# EAGLE design masterBoard1 (EAGLE 7.2.0)
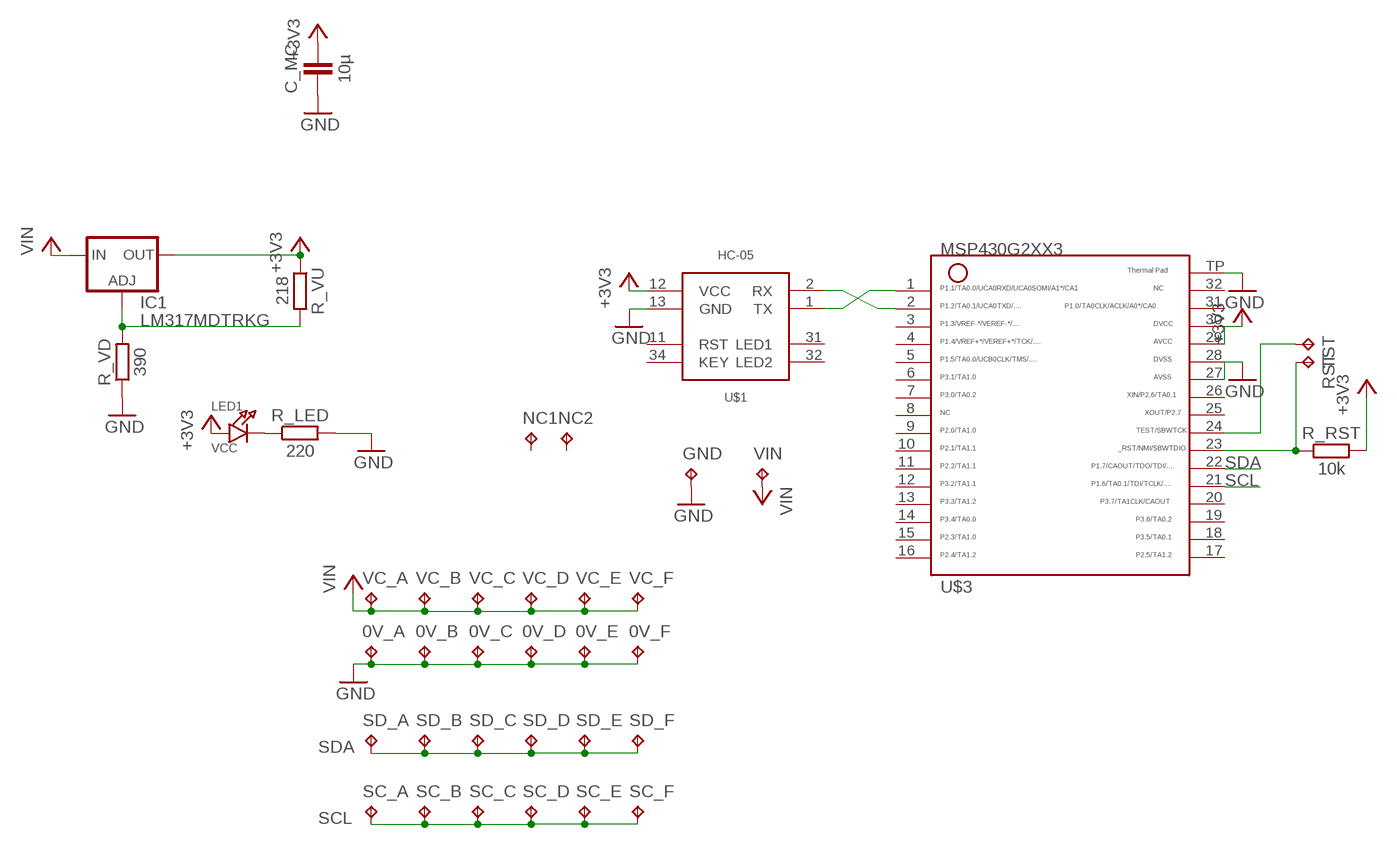
[diagram p0: schematic, sheet 1]

## Parts
0V_A  TPTP15SQ  [TP15SQ]
0V_B  TPTP15SQ  [TP15SQ]
0V_C  TPTP15SQ  [TP15SQ]
0V_D  TPTP15SQ  [TP15SQ]
0V_E  TPTP15SQ  [TP15SQ]
0V_F  TPTP15SQ  [TP15SQ]
C_MC  10µ  CAPACITOR  [603]
GND  TPTP15SQ  [TP15SQ]
IC1  LM317MDTRKG  [DPACK]
LED1  VCC  LED0805  [CHIPLED_0805]
NC1  TPTP15SQ  [TP15SQ]
NC2  TPTP15SQ  [TP15SQ]
R_LED  220  RESISTOR0603  [603]
R_RST  10k  RESISTOR0603  [603]
R_VD  390  RESISTOR0603  [603]
R_VU  218  RESISTOR0603  [603]
RST  TPTP15SQ  [TP15SQ]
SC_A  TPTP15SQ  [TP15SQ]
SC_B  TPTP15SQ  [TP15SQ]
SC_C  TPTP15SQ  [TP15SQ]
SC_D  TPTP15SQ  [TP15SQ]
SC_E  TPTP15SQ  [TP15SQ]
SC_F  TPTP15SQ  [TP15SQ]
SD_A  TPTP15SQ  [TP15SQ]
SD_B  TPTP15SQ  [TP15SQ]
SD_C  TPTP15SQ  [TP15SQ]
SD_D  TPTP15SQ  [TP15SQ]
SD_E  TPTP15SQ  [TP15SQ]
SD_F  TPTP15SQ  [TP15SQ]
TST  TPTP15SQ  [TP15SQ]
U$1  HC-05  [HC-06]
U$3  G2XX3---RHB32  [RHB32]
VC_A  TPTP15SQ  [TP15SQ]
VC_B  TPTP15SQ  [TP15SQ]
VC_C  TPTP15SQ  [TP15SQ]
VC_D  TPTP15SQ  [TP15SQ]
VC_E  TPTP15SQ  [TP15SQ]
VC_F  TPTP15SQ  [TP15SQ]
VIN  TPTP15SQ  [TP15SQ]

## Nets
+3V3: C_MC.2 IC1.4(OUT) LED1.A R_RST.2 R_VU.1 U$1.12(VCC) U$3.29 U$3.30
GND: 0V_A.TP 0V_B.TP 0V_C.TP 0V_D.TP 0V_E.TP 0V_F.TP C_MC.1 GND.TP R_LED.2 R_VD.1 U$1.13(GND) U$3.27 U$3.28 U$3.TP
N$1: LED1.C R_LED.1
N$2: R_RST.1 RST.TP U$3.23
N$3: U$1.1(TX) U$3.1
N$4: U$1.2(RX) U$3.2
N$5: TST.TP U$3.24
N$18: IC1.1(ADJ) R_VD.2 R_VU.2
SCL: SC_A.TP SC_B.TP SC_C.TP SC_D.TP SC_E.TP SC_F.TP U$3.21
SDA: SD_A.TP SD_B.TP SD_C.TP SD_D.TP SD_E.TP SD_F.TP U$3.22
VCC: IC1.3(IN) VC_A.TP VC_B.TP VC_C.TP VC_D.TP VC_E.TP VC_F.TP VIN.TP ; supply symbol labelled VIN
Unconnected: NC1.TP NC2.TP U$1.11(RST) U$1.31(LED1) U$1.32(LED2) U$1.34(KEY) U$3.3 U$3.4 U$3.5 U$3.6 U$3.7 U$3.8 U$3.9 U$3.10 U$3.11 U$3.12 U$3.13 U$3.14 U$3.15 U$3.16 U$3.17 U$3.18 U$3.19 U$3.20 U$3.25 U$3.26 U$3.31 U$3.32

## Library data of the parts
0V_A 0V_B 0V_C 0V_D 0V_E 0V_F GND NC1 NC2 RST SC_A SC_B SC_C SC_D SC_E SC_F SD_A SD_B SD_C SD_D SD_E SD_F TST VC_A VC_B VC_C VC_D VC_E VC_F VIN = testpad:TP: Test pad
C_MC = thar:CAPACITOR
IC1 = v-reg:LM317?*: 500 mA Adjustable Output Positive Voltage Regulator Source: http://www.onsemi.co.jp .. LM317M-D.PDF
LED1 = microbuilder:LED: LED 0603 - 0603 Surface Mount Package 2mA: Green LED - Low Power (3.9mcd, 2ma, 1.7Vf) - Digikey: 475-2709-2-ND Orange LED - Low Power (9.8mcd, 2ma, 1.8Vf) - Digikey: 475-1194-2-ND Red LED - Low Power (5mcd, 2ma, 1.8Vf) - Digikey: 475-1195-2-ND Yellow LED - Low Power (7mcd, 2ma, 1.8Vf) - Digikey: 475-1196-2-ND 5mA: Blue LED - Low Power (17mcd, 5ma, 2.9Vf) - Digikey: LNJ937W8CRACT-ND 0805 - 0805 Surface Mount Package 2mA: Red LED (8.8mcd, 2mA, 1.8Vf, Clear) - Low Power [Digikey: 475-2510-1-ND] Green LED (5mcd, 2mA, 1.8Vf, Clear) - Low Power [Digikey: 475-2730-1-ND] Yellow LED (11.3mcd, 2mA, 1.8Vf, Clear) - Low Power [Digikey: 475-2555-1-ND] 20mA: Red LED (104mcd, 20mA, Diffused) - LS R976 [Digikey: 475-1278-6-ND] Red LED (12mcd, 20mA, 2.0Vf, Clear) - APT2012EC [Digikey: 754-1128-1-ND] Green LED (15mcd, 20mA, 2.2Vf, Clear) - APT2012GC [Digikey: 754-1131-1-ND] Orange LED (160mcd, 20mA, 2.1Vf, Clear) - APT2012SECK [Digikey: 754-1130-1-ND] 1206 - 1206 Surface Mount Package Green LED (26mcd, 20mA, Diffused) - LG N971 [Digikey: 475-1407-6-ND] Red LED (15mcd, 20mA, Diffused) - LH N974 [Digikey: 475-1416-6-ND]
R_LED R_RST R_VD R_VU = thar:RESISTOR
U$1 = thar:HC-05: Wireless Bluetooth Transceiver Module HC-05 (Host-Slave integration) CP06001 Bezug: Ebay-Eckstein <http://stores.ebay.de/ecksteinkomponente/>
U$3 = TI_MSP430_v16:G2XX3---RHB32: MSP430G2XX1 QFN (RHB) 32 Pin Package

## Board
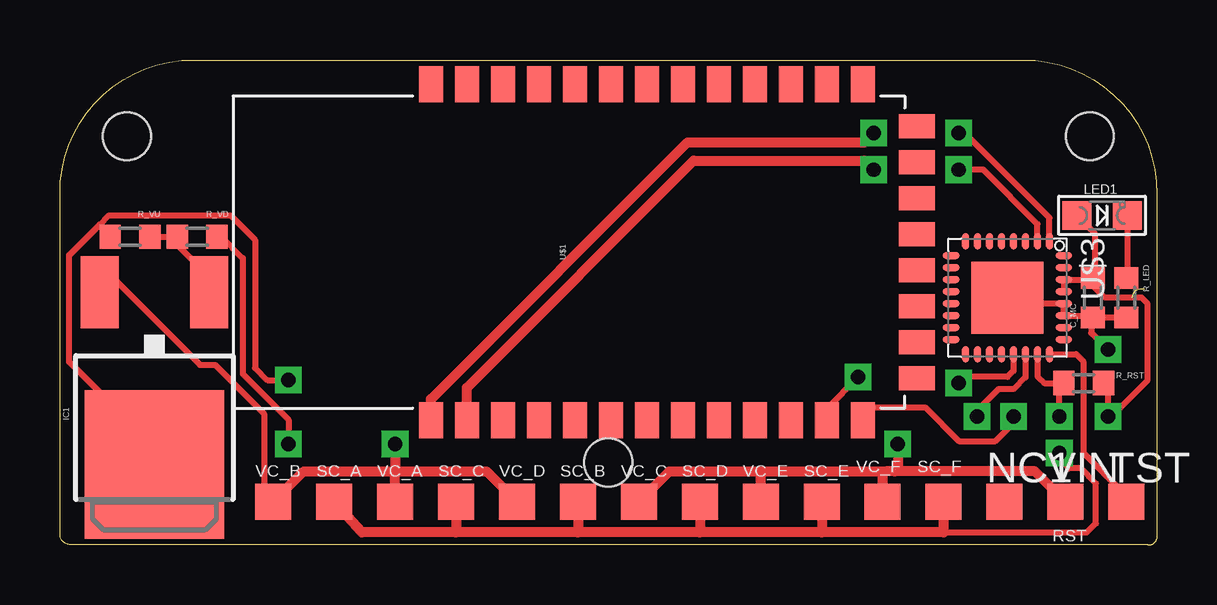
[diagram p1: board, top side]
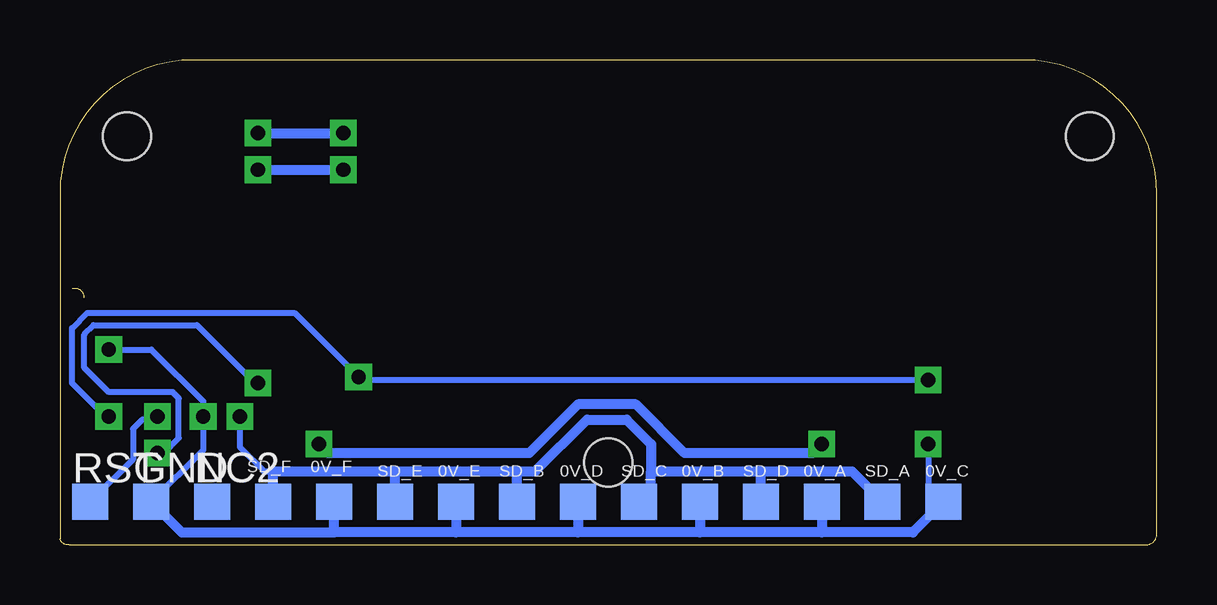
[diagram p2: board, bottom side, seen from below]

Size 45.72 x 20.2 mm. Coordinates in mm from the lower left corner, seen from the top.
Outline: 0.38,0.01 arc-74 0,0.39
Outline: 0,14.61 arc-91 5.59,20.2
Outline: 40.13,20.2 arc-91 45.72,14.61
Outline: 45.34,0.01 arc90 45.72,0.26
Outline: 0.38,0.01 arc-74 0,0.39
Outline: 0,0.39 0,14.61
Outline: 0,14.61 arc-91 5.59,20.2
Outline: 5.59,20.2 40.13,20.2
Outline: 40.13,20.2 arc-91 45.72,14.61
Outline: 45.72,14.61 45.72,0.26
Outline: 0.38,0.01 arc-74 0,0.39
Outline: 0,11.18 0,13.6
Outline: 45.72,13.6 45.72,11.18
Outline: 45.34,0.01 0.38,0.01
Outline: 45.34,0.01 arc90 45.72,0.26
Outline: 44.7,10.29 arc-90 45.08,10.67 45.21,10.67
Copper layers (1*16): Top 0.035mm / dielectric 1.5mm / Bottom 0.035mm
Design rules "PCBCart-Standard *": minimum track width 8mil, minimum drill 0.4mm, track to track 8mil, track to pad 8mil, pad to pad 8mil, via to via 8mil, smd to smd 8mil, copper to edge 20mil, drill to drill 8mil, minimum pad ring 8mil, minimum via ring 10mil, stop-mask expansion 3mil, vias tented up to drill 20mil, thermal gap 8mil
Holes 2 mm at 2.79,17.02 42.93,17.02 22.86,3.44

### Footprints (pad centres in the part's own frame; a part is rotated, then mirrored left to right if it is on the bottom)
TP15SQ = smd 1.5 x 1.5: TP 0,0
603 = smd 0.889 x 1.016: 1 -0.826,0; 2 0.826,0
DPACK = smd 1.6 x 3: 1 -2.28,-4.8; 3 2.28,-4.8 | smd 5.8 x 6.2: 4 0,2.38
CHIPLED_0805 = smd 1.2 x 1.2: A 0,-1.05; C 0,1.05
HC-06 = smd 1.5 x 1: 1 -7,5.75; 2 -7,4.25; 3 -7,2.75; 4 -7,1.25; 5 -7,-0.25; 6 -7,-1.75; 7 -7,-3.25; 8 -7,-4.75; 9 -7,-6.25; 10 -7,-7.75; 11 -7,-9.25; 12 -7,-10.75; 13 -7,-12.25; 22 7,-12.25; 23 7,-10.75; 24 7,-9.25; 25 7,-7.75; 26 7,-6.25; 27 7,-4.75; 28 7,-3.25; 29 7,-1.75; 30 7,-0.25; 31 7,1.25; 32 7,2.75; 33 7,4.25; 34 7,5.75 | smd 1 x 1.5: 14 -5.25,-14.5; 15 -3.75,-14.5; 16 -2.25,-14.5; 17 -0.75,-14.5; 18 0.75,-14.5; 19 2.25,-14.5; 20 3.75,-14.5; 21 5.25,-14.5
RHB32 = smd 0.7 x 0.3: 1 -2.35,1.75; 2 -2.35,1.25; 3 -2.35,0.75; 4 -2.35,0.25; 5 -2.35,-0.25; 6 -2.35,-0.75; 7 -2.35,-1.25; 8 -2.35,-1.75; 17 2.35,-1.75; 18 2.35,-1.25; 19 2.35,-0.75; 20 2.35,-0.25; 21 2.35,0.25; 22 2.35,0.75; 23 2.35,1.25; 24 2.35,1.75 | smd 0.3 x 0.7: 9 -1.75,-2.35; 10 -1.25,-2.35; 11 -0.75,-2.35; 12 -0.25,-2.35; 13 0.25,-2.35; 14 0.75,-2.35; 15 1.25,-2.35; 16 1.75,-2.35; 25 1.75,2.35; 26 1.25,2.35; 27 0.75,2.35; 28 0.25,2.35; 29 -0.25,2.35; 30 -0.75,2.35; 31 -1.25,2.35; 32 -1.75,2.35 | smd 3 x 3: TP 0,0

### Placement (x,y rotation side)
0V_A  13.97,1.78 0 bottom
0V_B  19.05,1.78 0 bottom
0V_C  8.89,1.78 0 bottom
0V_D  24.13,1.78 0 bottom
0V_E  29.21,1.78 0 bottom
0V_F  34.29,1.78 180 bottom
C_MC  43.05,10.29 90 top
GND  41.91,1.78 0 bottom
IC1  3.94,5.72 180 top
LED1  43.43,13.72 270 top
NC1  39.37,1.78 0 top
NC2  39.37,1.78 0 bottom
R_LED  44.45,10.29 270 top
R_RST  42.67,6.74 0 top
R_VD  5.72,12.83 180 top
R_VU  2.92,12.83 0 top
RST  44.45,1.78 0 bottom
SC_A  11.43,1.78 0 top
SC_B  21.59,1.78 0 top
SC_C  16.51,1.78 0 top
SC_D  26.67,1.78 0 top
SC_E  31.75,1.78 0 top
SC_F  36.83,1.78 180 top
SD_A  11.43,1.78 0 bottom
SD_B  26.67,1.78 0 bottom
SD_C  21.59,1.78 0 bottom
SD_D  16.51,1.78 0 bottom
SD_E  31.75,1.78 0 bottom
SD_F  36.83,1.78 180 bottom
TST  44.45,1.78 0 top
U$1  21.21,12.2 90 top
U$3  39.5,10.29 270 top
VC_A  13.97,1.78 0 top
VC_B  8.89,1.78 0 top
VC_C  24.13,1.78 0 top
VC_D  19.05,1.78 0 top
VC_E  29.21,1.78 0 top
VC_F  34.29,1.78 180 top
VIN  41.91,1.78 0 top

### Tracks (layer width: path | path; a pad name or v marks a point on that pad's centre or on a via)
+3V3  (via drill 0.6)
  Top 0.254: U$3.29 U$3.30 42.98,11.04 | R_RST.2 43.62,6.55 43.56,6.99 43.69,6.74 v43.69,5.34 43.81,5.34 45.34,6.86 45.34,10.04 45.08,10.29 43.56,10.29 42.98,10.88 42.98,11.04 | v33.27,6.99 31.96,5.68 U$1.12 31.88,5.12 32,4.83 | 42.98,11.04 C_MC.2 43.15,11.21 43.15,12.96 LED1.A | R_VU.1 2.29,12.77 2.22,12.77 1.65,13.34 | IC1.4 3.94,4.07 0.38,7.63 0.38,12.07 1.65,13.34 | 1.65,13.34 2.03,13.72 7.11,13.72 8.13,12.71 8.13,7.37 8.64,6.86 v9.52,6.86
  Bottom 0.254: v43.69,5.34 43.81,5.34 45.21,6.74 45.21,9.02 44.58,9.66 35.94,9.66 v33.27,6.99 33.15,6.86 v9.52,6.86
GND  (via drill 0.6)
  Top 0.254: 33.46,4.77 U$1.13 33.46,5.4 33.53,5.72 36.07,5.72 37.46,4.32 38.99,4.32 39.75,5.09 v39.75,5.34 | 42.99,9.47 C_MC.1 R_LED.2 | 42.99,9.47 42.93,9.53 41.86,9.53 U$3.27 U$3.28 39.75,10.04 U$3.TP | 42.99,9.47 42.99,8.83 v43.69,8.13 | v9.52,4.2 9.52,5.21 7.62,7.12 7.62,11.94 6.73,12.83 R_VD.1
  Bottom 0.254: GND.TP 39.75,3.94 v39.75,5.34 39.75,5.98 41.91,8.13 v43.69,8.13 | v9.52,4.2 9.52,2.42 0V_C.TP
  Bottom 0.406: 0V_C.TP 10.16,0.51 13.97,0.51 | 13.97,0.51 19.05,0.51 | 19.05,0.51 24.13,0.51 | 24.13,0.51 29.21,0.51 | 29.21,0.51 34.29,0.51 | 34.29,0.51 0V_F.TP | 0V_A.TP 13.97,0.51 | 0V_B.TP 19.05,0.51 | 0V_D.TP 24.13,0.51 | 0V_E.TP 29.21,0.51 | 34.29,0.51 40.64,0.51 GND.TP 42.16,1.91
N$1
  Top 0.254: LED1.C 44.48,11.15 R_LED.1
N$2  (via drill 0.6)
  Top 0.254: 41.76,5.21 41.76,5.23 v41.66,5.34 41.66,6.8 R_RST.1 | 41.85,6.86 R_RST.1 | U$3.23 40.75,7.01 41.02,6.74 R_RST.1
  Bottom 0.254: v41.66,5.34 41.66,5.21 42.29,5.21 42.67,4.83 42.67,3.56 RST.TP 44.58,1.91 44.58,2.42
N$3  (via drill 0.6)
  Top 0.254: v37.46,17.15 37.72,17.15 41.25,13.62 U$3.1
  Top 0.406: U$1.1 15.46,6.07 26.16,16.77 33.53,16.77 v33.91,17.15
  Bottom 0.406: v37.46,17.15 v33.91,17.15
N$4  (via drill 0.6)
  Top 0.254: v37.46,15.63 38.48,15.63 40.75,13.36 U$3.2
  Top 0.406: U$1.2 16.96,6.55 26.42,16.01 33.53,16.01 v33.91,15.63
  Bottom 0.406: v37.46,15.63 v33.91,15.63
N$5
  Top 0.254: TST.TP 44.32,2.17 | 44.32,2.17 44.7,2.17 | 44.32,2.17 42.67,3.82 42.67,7.63 42.35,7.94 U$3.24
N$18
  Top 0.254: R_VU.2 R_VD.2 4.89,12.5 6.41,10.97 IC1.1
SCL  (via drill 0.6)
  Top 0.254: U$3.21 39.75,7.24 39.5,6.99 37.72,6.99 37.46,6.86 v37.46,6.74 | 36.83,0.51 42.8,0.51 43.18,0.9 43.18,2.55 42.54,3.18 42.04,3.18 v41.66,3.82
  Top 0.406: SC_F.TP 36.83,0.51 31.75,0.51 | 31.75,0.51 26.67,0.51 | 26.67,0.51 21.59,0.51 | 21.59,0.51 16.51,0.51 | 16.51,0.51 12.57,0.51 SC_A.TP | SC_C.TP 16,1.78 16,1.91 16.51,1.91 16.51,0.51 | SC_B.TP 21.59,0.51 | SC_D.TP 26.67,0.51 | SC_E.TP 31.75,0.51
  Bottom 0.254: v41.66,3.82 41.4,3.82 40.77,4.45 40.77,6.1 41.02,6.36 43.69,6.36 44.7,7.37 44.7,8.77 44.32,9.15 40,9.15 37.59,6.74 v37.46,6.74
SDA  (via drill 0.6)
  Top 0.254: U$3.22 40.25,6.98 39.75,6.48 39.12,6.48 38.23,5.59 v38.23,5.34
  Bottom 0.254: v38.23,5.34 38.23,4.07 37.21,3.05 36.83,3.05
  Bottom 0.406: SD_F.TP 36.83,3.05 31.75,3.05 | 31.75,3.05 26.67,3.05 | 26.67,3.05 25.91,3.05 23.75,5.21 22.1,5.21 21.08,4.2 21.08,3.05 | 21.08,3.05 16.51,3.05 | 16.51,3.05 12.7,3.05 SD_A.TP | SD_D.TP 16.51,3.05 | SD_C.TP 21.21,1.78 21.08,1.91 21.08,3.05 | SD_B.TP 26.67,3.05 | SD_E.TP 31.75,3.05
VCC  (via drill 0.6)
  Top 0.254: 1.66,10.03 IC1.3 1.66,10.54 1.02,11.18 2.16,11.18 5.84,7.5 6.48,7.5 8.51,5.47 8.51,2.17 VC_B.TP
  Top 0.406: VC_B.TP 10.16,3.05 13.97,3.05 | 13.97,3.05 17.78,3.05 VC_D.TP | 29.21,3.05 25.4,3.05 VC_C.TP | 29.21,3.05 34.29,3.05 34.29,2.93 | 34.29,2.93 VC_F.TP | VC_A.TP 13.97,3.05 | VC_E.TP 29.21,3.05 | VIN.TP 40.64,3.05 34.8,3.05 | 34.8,3.05 34.42,3.05 34.29,2.93 | v13.97,4.2 13.97,3.05 | v34.92,4.2 34.92,3.18 34.8,3.05
  Bottom 0.406: v13.97,4.2 14.35,3.82 19.69,3.82 21.72,5.85 24.13,5.85 26.16,3.82 34.54,3.82 v34.92,4.2

### Text on the board
tPlace: RST